# EAGLE design ou6_cs-ctrl V1.1 (EAGLE 7.6.0)
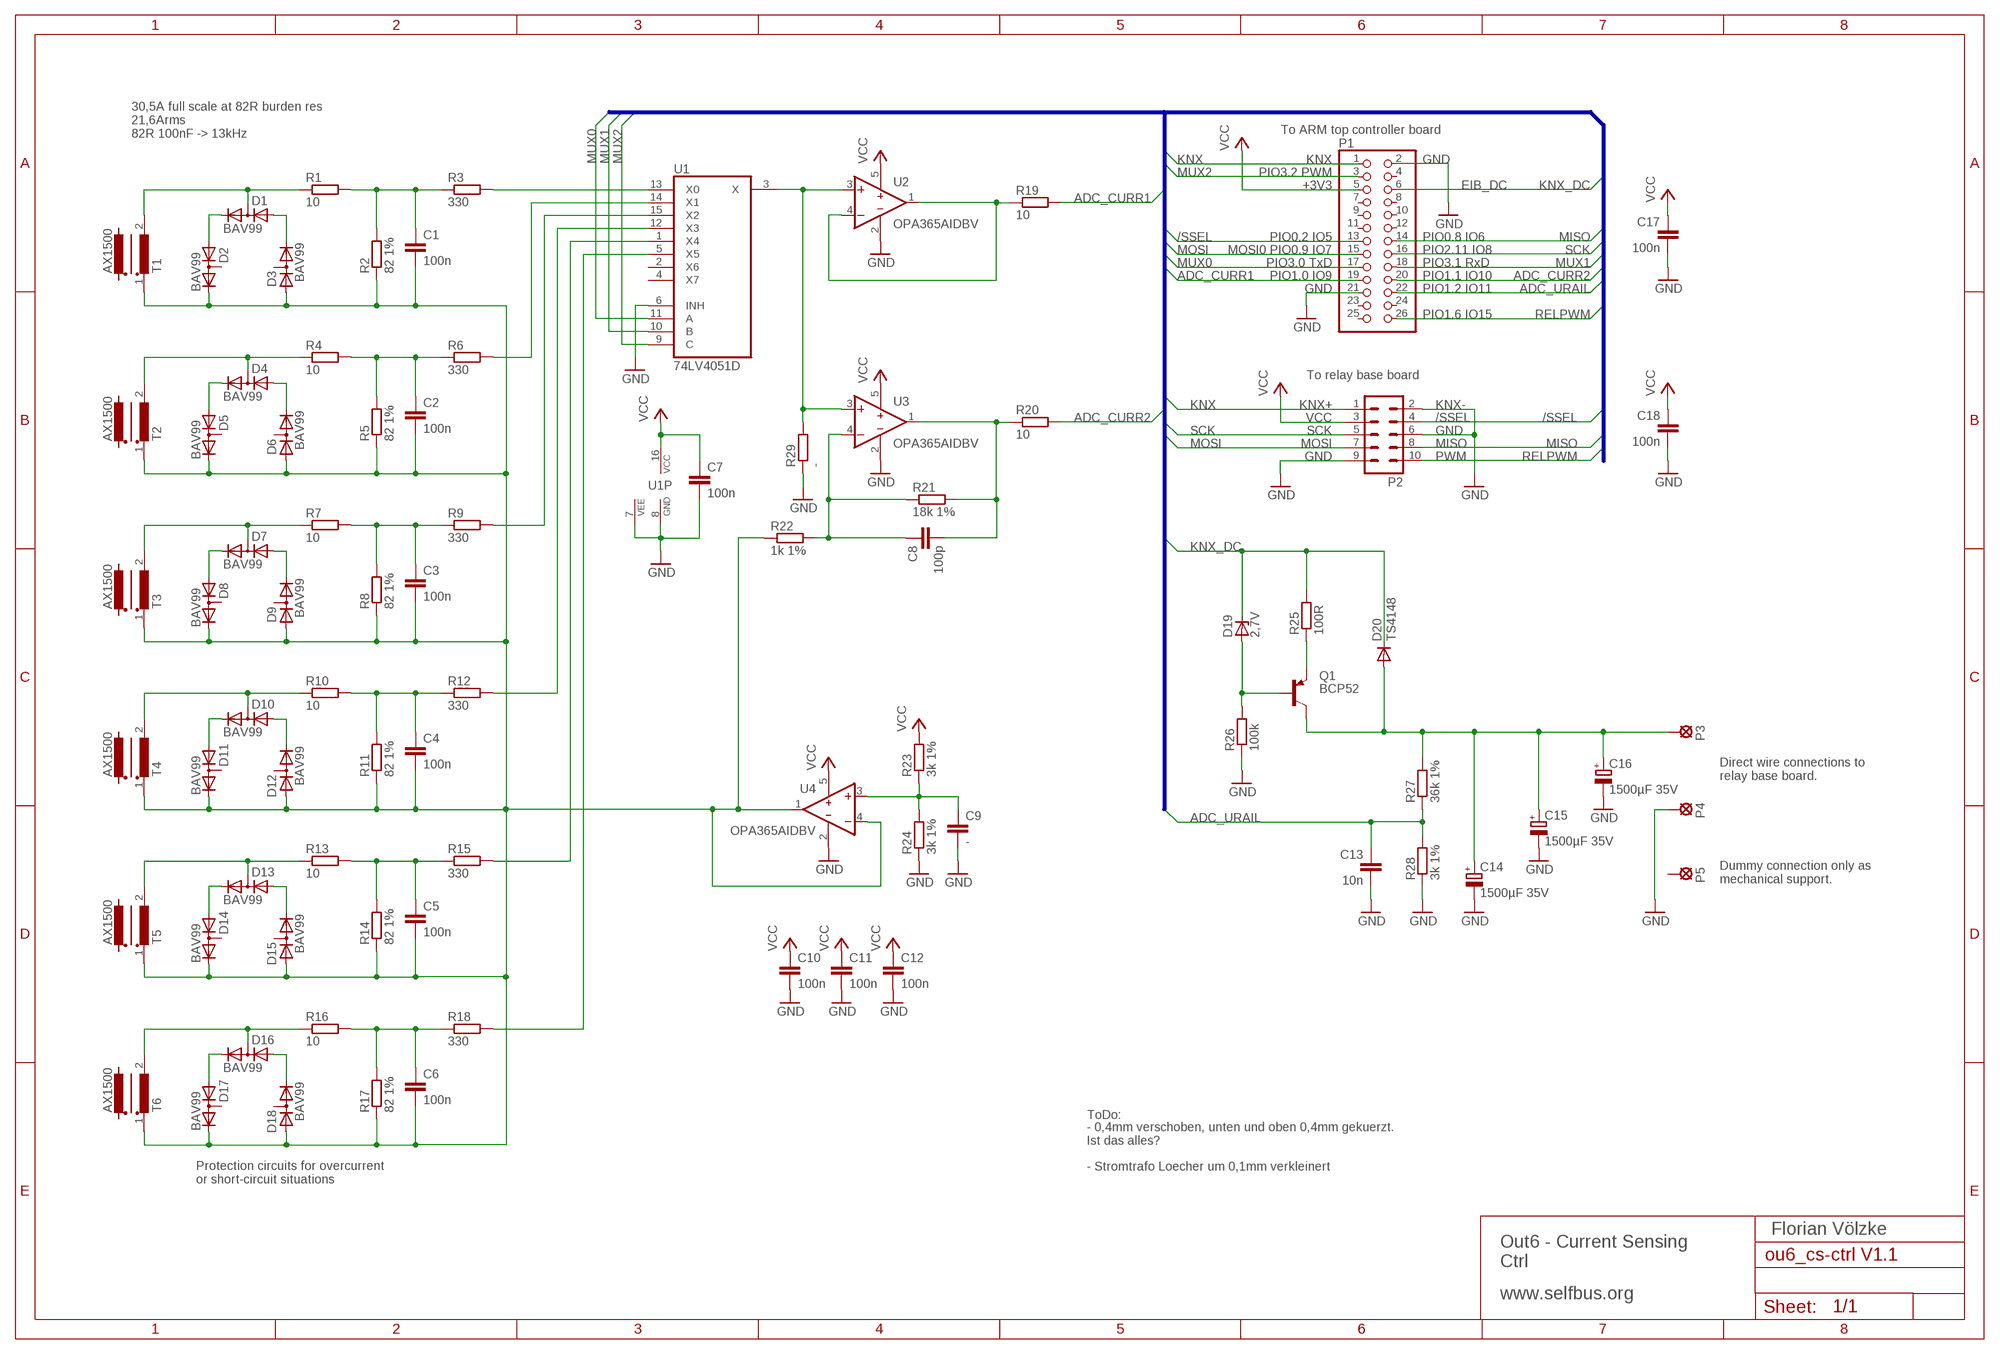
[diagram p0: schematic, sheet 1]

## Parts
C1  100n  C-EUC0805M  [R0805M]
C2  100n  C-EUC0805M  [R0805M]
C3  100n  C-EUC0805M  [R0805M]
C4  100n  C-EUC0805M  [R0805M]
C5  100n  C-EUC0805M  [R0805M]
C6  100n  C-EUC0805M  [R0805M]
C7  100n  C-EUC0805M  [R0805M]
C8  100p  C-EUC0805M  [R0805M]
C9  -  C-EUC0805M  [R0805M]
C10  100n  C-EUC0805M  [R0805M]
C11  100n  C-EUC0805M  [R0805M]
C12  100n  C-EUC0805M  [R0805M]
C13  10n  C-EUC0805M  [R0805M]
C14  1500µF 35V  CPOL-EUE5-13-30  [E5-13-30]
C15  1500µF 35V  CPOL-EUE5-13-30  [E5-13-30]
C16  1500µF 35V  CPOL-EUE5-13-30  [E5-13-30]
C17  100n  C-EUC0805M  [R0805M]
C18  100n  C-EUC0805M  [R0805M]
D1  BAV99  DIODE_2CACA-SOT23  [SOT23]
D2  BAV99  DIODE_2CACA-SOT23  [SOT23]
D3  BAV99  DIODE_2CACA-SOT23  [SOT23]
D4  BAV99  DIODE_2CACA-SOT23  [SOT23]
D5  BAV99  DIODE_2CACA-SOT23  [SOT23]
D6  BAV99  DIODE_2CACA-SOT23  [SOT23]
D7  BAV99  DIODE_2CACA-SOT23  [SOT23]
D8  BAV99  DIODE_2CACA-SOT23  [SOT23]
D9  BAV99  DIODE_2CACA-SOT23  [SOT23]
D10  BAV99  DIODE_2CACA-SOT23  [SOT23]
D11  BAV99  DIODE_2CACA-SOT23  [SOT23]
D12  BAV99  DIODE_2CACA-SOT23  [SOT23]
D13  BAV99  DIODE_2CACA-SOT23  [SOT23]
D14  BAV99  DIODE_2CACA-SOT23  [SOT23]
D15  BAV99  DIODE_2CACA-SOT23  [SOT23]
D16  BAV99  DIODE_2CACA-SOT23  [SOT23]
D17  BAV99  DIODE_2CACA-SOT23  [SOT23]
D18  BAV99  DIODE_2CACA-SOT23  [SOT23]
D19  2,7V  ZENER-DIODESOT23  [SOT23]
D20  TS4148  DIODE-D0805  [D0805]
P1  PINHD-2X13SMD  [2X13SMD]
P2  ML10  [ML10]
P3  SE1.5  [SE15]
P4  SE1.5  [SE15]
P5  SE1.5  [SE15]
Q1  BCP52  FZT753SMD  [SOT223]
R1  10  R-EU_R0805M  [R0805M]
R2  82 1%  R-EU_R0805M  [R0805M]
R3  330  R-EU_R0805M  [R0805M]
R4  10  R-EU_R0805M  [R0805M]
R5  82 1%  R-EU_R0805M  [R0805M]
R6  330  R-EU_R0805M  [R0805M]
R7  10  R-EU_R0805M  [R0805M]
R8  82 1%  R-EU_R0805M  [R0805M]
R9  330  R-EU_R0805M  [R0805M]
R10  10  R-EU_R0805M  [R0805M]
R11  82 1%  R-EU_R0805M  [R0805M]
R12  330  R-EU_R0805M  [R0805M]
R13  10  R-EU_R0805M  [R0805M]
R14  82 1%  R-EU_R0805M  [R0805M]
R15  330  R-EU_R0805M  [R0805M]
R16  10  R-EU_R0805M  [R0805M]
R17  82 1%  R-EU_R0805M  [R0805M]
R18  330  R-EU_R0805M  [R0805M]
R19  10  R-EU_R0805M  [R0805M]
R20  10  R-EU_R0805M  [R0805M]
R21  18k 1%  R-EU_R0805M  [R0805M]
R22  1k 1%  R-EU_R0805M  [R0805M]
R23  3k 1%  R-EU_R0805M  [R0805M]
R24  3k 1%  R-EU_R0805M  [R0805M]
R25  100R  R-EU_R0805M  [R0805M]
R26  100k  R-EU_R0805M  [R0805M]
R27  36k 1%  R-EU_R0805M  [R0805M]
R28  3k 1%  R-EU_R0805M  [R0805M]
R29  -  R-EU_R0805M  [R0805M]
T1  AX1500  STROMWANDLERTALEMA_AX1500  [SMALLXFORMER]
T2  AX1500  STROMWANDLERTALEMA_AX1500  [SMALLXFORMER]
T3  AX1500  STROMWANDLERTALEMA_AX1500  [SMALLXFORMER]
T4  AX1500  STROMWANDLERTALEMA_AX1500  [SMALLXFORMER]
T5  AX1500  STROMWANDLERTALEMA_AX1500  [SMALLXFORMER]
T6  AX1500  STROMWANDLERTALEMA_AX1500  [SMALLXFORMER]
U1  74LV4051D  4051D  [SO16]
U2  OPA365AIDBV  LTC2050CS5  [SOT23-5]
U3  OPA365AIDBV  LTC2050CS5  [SOT23-5]
U4  OPA365AIDBV  LTC2050CS5  [SOT23-5]

## Nets
/SSEL: P1.13 P2.4
ADC_CURR1: P1.19 R19.2
ADC_CURR2: P1.20 R20.2
ADC_URAIL: C13.1 P1.22 R27.1 R28.2
GND: C7.2 C9.2 C10.2 C11.2 C12.2 C13.2 C14.- C15.- C16.- C17.2 C18.2 P1.2 P1.21 P2.2 P2.6 P2.9 P4.MP R24.1 R26.1 R28.1 R29.1 U1.6(INH) U1.7(VEE) U1.8(GND) U2.2(V-) U3.2(V-) U4.2(V-)
KNX: P1.1 P2.1
KNX_DC: D19.3(C) D20.C P1.6 R25.2
MISO: P1.14 P2.8
MOSI: P1.15 P2.7
MUX0: P1.17 U1.11(A)
MUX1: P1.18 U1.10(B)
MUX2: P1.3 U1.9(C)
N$1: R19.1 U2.1(OUT) U2.4(-IN)
N$2: D1.3(AC) R1.1 T1.2(W1E)
N$3: D1.2(C) D2.1(A)
N$4: D1.1(A) D3.2(C)
N$5: C1.1 R1.2 R2.2 R3.1
N$6: Q1.3(E) R25.1
N$7: D4.3(AC) R4.1 T2.2(W1E)
N$8: D4.2(C) D5.1(A)
N$9: D4.1(A) D6.2(C)
N$10: C2.1 R4.2 R5.2 R6.1
N$11: C8.2 R20.1 R21.2 U3.1(OUT)
N$12: D7.3(AC) R7.1 T3.2(W1E)
N$13: D7.2(C) D8.1(A)
N$14: D7.1(A) D9.2(C)
N$15: C3.1 R7.2 R8.2 R9.1
N$16: R29.2 U1.3(X) U2.3(+IN) U3.3(+IN)
N$17: D10.3(AC) R10.1 T4.2(W1E)
N$18: D10.2(C) D11.1(A)
N$19: D10.1(A) D12.2(C)
N$20: C4.1 R10.2 R11.2 R12.1
N$21: C8.1 R21.1 R22.2 U3.4(-IN)
N$22: D13.3(AC) R13.1 T5.2(W1E)
N$23: D13.2(C) D14.1(A)
N$24: D13.1(A) D15.2(C)
N$25: C5.1 R13.2 R14.2 R15.1
N$26: C1.2 C2.2 C3.2 C4.2 C5.2 C6.2 D2.2(C) D3.1(A) D5.2(C) D6.1(A) D8.2(C) D9.1(A) D11.2(C) D12.1(A) D14.2(C) D15.1(A) D17.2(C) D18.1(A) R2.1 R5.1 R8.1 R11.1 R14.1 R17.1 R22.1 T1.1(W1A) T2.1(W1A) T3.1(W1A) T4.1(W1A) T5.1(W1A) T6.1(W1A) U4.1(OUT) U4.4(-IN)
N$27: D16.3(AC) R16.1 T6.2(W1E)
N$28: D16.2(C) D17.1(A)
N$29: D16.1(A) D18.2(C)
N$30: C6.1 R16.2 R17.2 R18.1
N$31: R3.2 U1.13(X0)
N$32: R6.2 U1.14(X1)
N$33: R9.2 U1.15(X2)
N$34: R12.2 U1.12(X3)
N$35: R15.2 U1.1(X4)
N$36: R18.2 U1.5(X5)
N$37: C9.1 R23.1 R24.2 U4.3(+IN)
N$38: C14.+ C15.+ C16.+ D20.A P3.MP Q1.2(C) Q1.4(C) R27.2
N$41: D19.1(A) Q1.1(B) R26.2
RELPWM: P1.26 P2.10
SCK: P1.16 P2.5
VCC: C7.1 C10.1 C11.1 C12.1 C17.1 C18.1 P1.5 P2.3 R23.2 U1.16(VCC) U2.5(V+) U3.5(V+) U4.5(V+)
Unconnected: D2.3(AC) D3.3(AC) D5.3(AC) D6.3(AC) D8.3(AC) D9.3(AC) D11.3(AC) D12.3(AC) D14.3(AC) D15.3(AC) D17.3(AC) D18.3(AC) P1.4 P1.7 P1.8 P1.9 P1.10 P1.11 P1.12 P1.23 P1.24 P1.25 P5.MP U1.2(X6) U1.4(X7)

## Buses
MUX[0..2],ADC_CURR[1..2],ADC_URAIL,RELPWM,/SSEL,SCK,MOSI,MISO,KNX,KNX_DC

## Notes on the sheet
- To ARM top controller board
- 30,5A full scale at 82R burden res
  21,6Arms
  82R 100nF -> 13kHz
- KNX | GND
- PIO3.2 PWM
- +3V3 | EIB_DC
- PIO0.2 IO5 | PIO0.8 IO6
- MOSI0 PIO0.9 IO7 | PIO2.11 IO8
- PIO3.0 TxD | PIO3.1 RxD
- PIO1.0 IO9 | PIO1.1 IO10
- GND | PIO1.2 IO11
- PIO1.6 IO15
- To relay base board
- KNX+ | KNX-
- VCC | /SSEL
- SCK | GND
- MOSI | MISO
- GND | PWM
- Direct wire connections to
  relay base board.
- Dummy connection only as
  mechanical support.
- ToDo:
- - 0,4mm verschoben, unten und oben 0,4mm gekuerzt.
  Ist das alles?
- - Stromtrafo Loecher um 0,1mm verkleinert
- Protection circuits for overcurrent
  or short-circuit situations
- Out6 - Current Sensing
  Ctrl
- Florian Völzke
- www.selfbus.org

## Library data of the parts
C1-C13 C17 C18 = rcl:C-EU: CAPACITOR, European symbol
C14-C16 = rcl:CPOL-EU: POLARIZED CAPACITOR, European symbol
D1-D18 = diode:DIODE_2CACA-: 2 Diodes - Cathode-Anode|Cathode-Anode
D19 = diode:ZENER-DIODE: Z-Diode
D20 = diode:DIODE-: DIODE
P1 = pinhead:PINHD-2X13: PIN HEADER
P2 = con-harting-ml:ML10: HARTING; OC_FARNELL: unknown; OC_NEWARK: unknown
P3-P5 = solpad:SE: SOLDER PAD drill in mm
Q1 = transistor-pnp:FZT753SMD: PNP Transistor
R1-R29 = rcl:R-EU_: RESISTOR, European symbol
T1-T6 = eigene:STROMWANDLER
U1 = 40xx:4051: 8-channel ANALOG MULTIPLEXER
U2-U4 = eigene:LTC2050

## Board
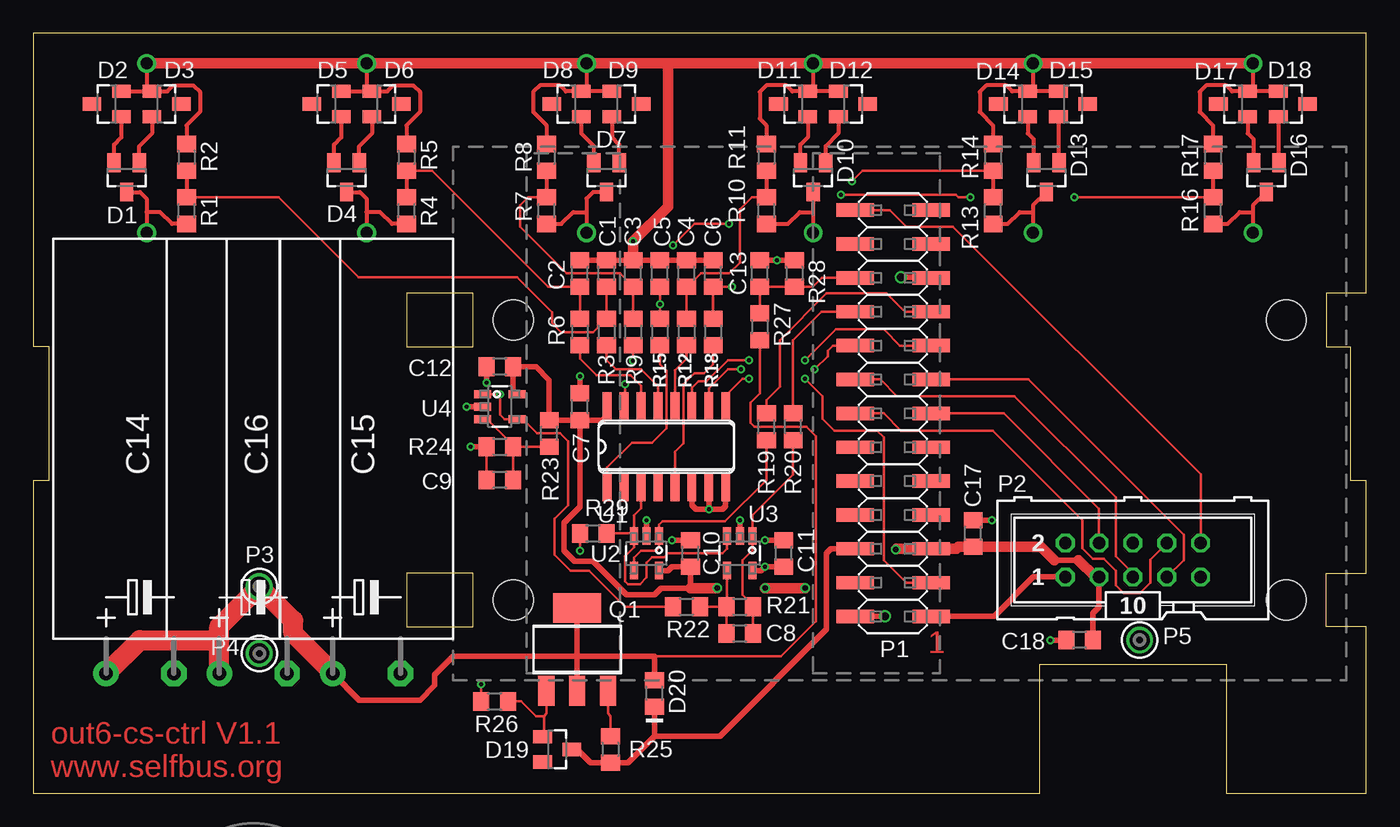
[diagram p1: board, top side]
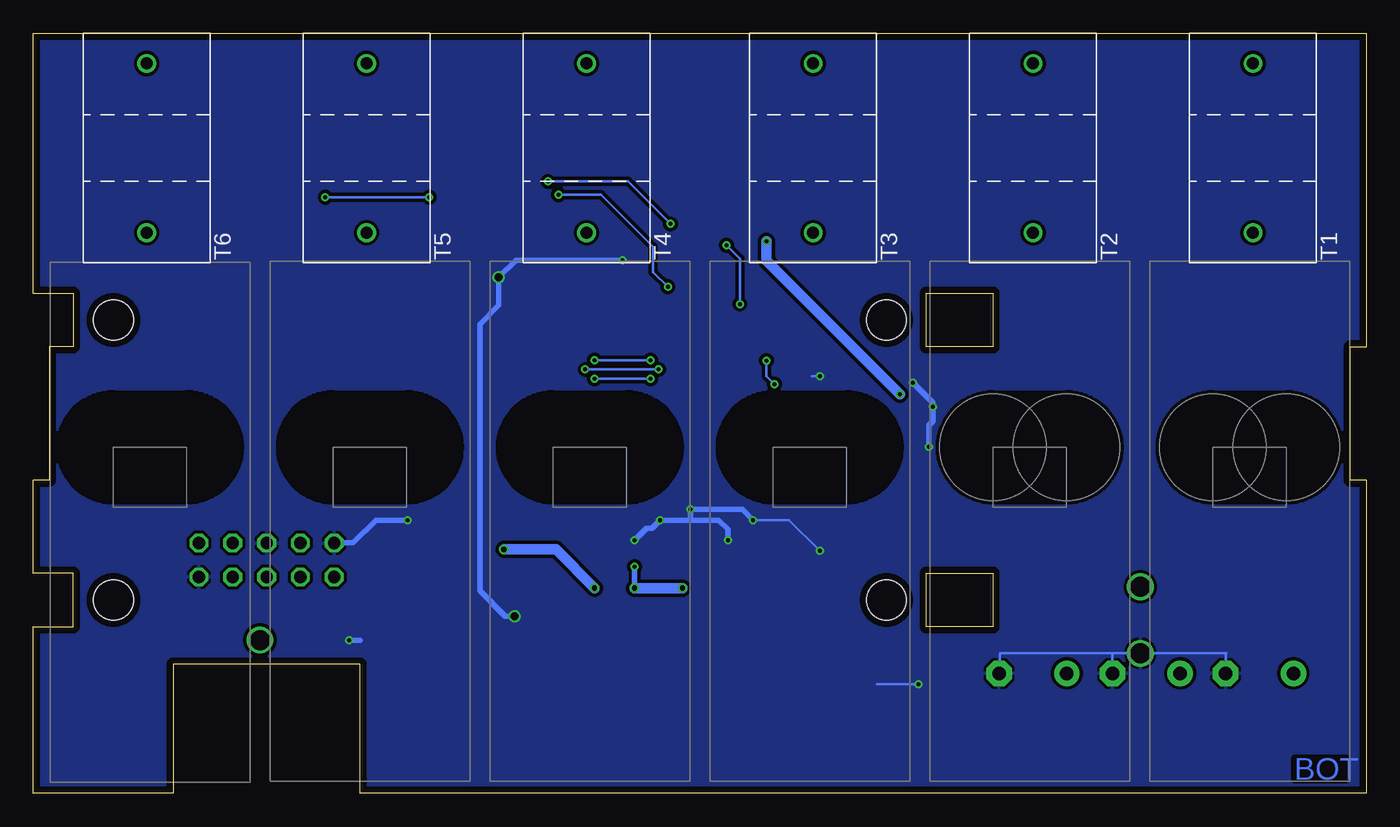
[diagram p2: board, bottom side, seen from below]

Size 100 x 57 mm. Coordinates in mm from the lower left corner, seen from the top.
Outline: 0,0 75.5,0 75.5,9.7 89.5,9.7 89.5,0 100,0 100,12.5 97,12.5 97,16.5 100,16.5 100,23.5 98.8,23.5 98.8,33.5 97,33.5 97,37.5 100,37.5 100,57 0,57 0,33.5 1.2,33.5 1.2,23.5 0,23.5 0,0
Outline: 33,37.5 28,37.5 28,33.5 33,33.5 33,37.5
Outline: 33,16.5 28,16.5 28,12.5 33,12.5 33,16.5
Copper layers (1*16): Top 0.035mm / dielectric 1.5mm / Bottom 0.035mm
Design rules "default *": minimum track width 0.2mm, minimum drill 0.3mm, track to track 0.2mm, track to pad 0.2mm, pad to pad 0.2mm, via to via 0.2mm, smd to smd 0.2mm, copper to edge 0.5mm, drill to drill 0.5mm, minimum pad ring 0.25mm, minimum via ring 0.15mm, stop-mask expansion 4mil, vias tented up to drill 0.6mm, thermal gap 0.2mm
Holes 3 mm at 94,35.5 94,14.5 36,14.5 36,35.5
bRestrict: area 2,21.9 to 15.5,29.9; area 18.5,21.9 to 32,29.9; area 35,21.9 to 48.5,29.9; area 51.5,21.9 to 65,29.9; area 68,21.9 to 81.5,29.9; area 84.5,21.9 to 98,29.9

### Footprints (pad centres in the part's own frame; a part is rotated, then mirrored left to right if it is on the bottom)
R0805M = smd 1.2 x 1.4: 1 -1,0; 2 1,0
E5-13-30 = drill 1.016 pad 1.905: + -2.54,0 | drill 1.016 pad 1.905 octagon: - 2.54,0
SOT23 = smd 1 x 1.4: 1 -0.95,-1.1; 2 0.95,-1.1; 3 0,1.1
D0805 = smd 1.2 x 1.4: A 1,0; C -1,0
2X13SMD = smd 1 x 2.8: 1 -15.24,-2.85; 2 -15.24,2.85; 3 -12.7,-2.85; 4 -12.7,2.85; 5 -10.16,-2.85; 6 -10.16,2.85; 7 -7.62,-2.85; 8 -7.62,2.85; 9 -5.08,-2.85; 10 -5.08,2.85; 11 -2.54,-2.85; 12 -2.54,2.85; 13 0,-2.85; 14 0,2.85; 15 2.54,-2.85; 16 2.54,2.85; 17 5.08,-2.85; 18 5.08,2.85; 19 7.62,-2.85; 20 7.62,2.85; 21 10.16,-2.85; 22 10.16,2.85; 23 12.7,-2.85; 24 12.7,2.85; 25 15.24,-2.85; 26 15.24,2.85
ML10 = drill 0.914 octagon: 1 -5.08,-1.27; 2 -5.08,1.27; 3 -2.54,-1.27; 4 -2.54,1.27; 5 0,-1.27; 6 0,1.27; 7 2.54,-1.27; 8 2.54,1.27; 9 5.08,-1.27; 10 5.08,1.27
SE15 = drill 1.5: MP 0,0
SOT223 = smd 1.219 x 2.235: 1 -2.311,-3.099; 2 0,-3.099; 3 2.311,-3.099 | smd 3.6 x 2.2: 4 0,3.099
SMALLXFORMER = drill 0.9: 1 -6.35,0; 2 6.35,0
SO16 = smd 0.66 x 2.032: 1 -4.445,-3.073; 2 -3.175,-3.073; 3 -1.905,-3.073; 4 -0.635,-3.073; 5 0.635,-3.073; 6 1.905,-3.073; 7 3.175,-3.073; 8 4.445,-3.073; 9 4.445,3.073; 10 3.175,3.073; 11 1.905,3.073; 12 0.635,3.073; 13 -0.635,3.073; 14 -1.905,3.073; 15 -3.175,3.073; 16 -4.445,3.073
SOT23-5 = smd 1.3 x 0.6: 1 -1.295,0.94; 2 -1.295,0; 3 -1.295,-0.94; 4 1.295,-0.94; 5 1.295,0.94

### Placement (x,y rotation side)
C1  43,39 90 top
C2  41,39 90 top
C3  45,39 90 top
C4  49,39 90 top
C5  47,39 90 top
C6  51,39 90 top
C7  41,29 90 top
C8  53,12 0 top
C9  35,23.5 180 top
C10  49.3,18 90 top
C11  56.3,18 90 top
C12  35,32 180 top
C13  54.5,39 90 top
C14  8,9 0 top
C15  25,9 0 top
C16  16.5,9 0 top
C17  70.5,19.5 90 top
C18  78.5,11.5 180 top
D1  7,46.2 180 top
D2  5.5,51.7 90 top
D3  10,51.7 270 top
D4  23.5,46.2 180 top
D5  22,51.7 90 top
D6  26.5,51.7 270 top
D7  43,46.2 180 top
D8  40,51.7 90 top
D9  44.5,51.7 270 top
D10  58.5,46.2 180 top
D11  57,51.7 90 top
D12  61.5,51.7 270 top
D13  76,46.2 180 top
D14  73.5,51.7 90 top
D15  78,51.7 270 top
D16  92.5,46.2 180 top
D17  90,51.7 90 top
D18  94.5,51.7 270 top
D19  39.3,3.3 270 top
D20  46.6,7.5 90 top
P1  64.5,28.5 90 top
P2  82.5,17.5 0 top
P3  16.95,15.5 0 top
P4  16.95,10.5 0 top
P5  83,11.5 0 top
Q1  40.8,10.8 0 top
R1  11.5,43.7 90 top
R2  11.5,47.7 270 top
R3  43,34.6 270 top
R4  28,43.7 90 top
R5  28,47.7 270 top
R6  41,34.6 270 top
R7  38.5,43.7 90 top
R8  38.5,47.7 270 top
R9  45,34.6 270 top
R10  55,43.7 90 top
R11  55,47.7 270 top
R12  49,34.6 270 top
R13  72,43.7 90 top
R14  72,47.7 270 top
R15  47,34.6 270 top
R16  88.5,43.7 90 top
R17  88.5,47.7 270 top
R18  51,34.6 270 top
R19  55,27.5 90 top
R20  57,27.5 90 top
R21  53,14 0 top
R22  49,14 0 top
R23  38.7,27 90 top
R24  35,26 0 top
R25  43.3,3.3 270 top
R26  34.6,6.9 0 top
R27  54.5,35 270 top
R28  57.1,39 270 top
R29  42,19.5 0 top
T1  8.5,48.4 270 bottom
T2  25,48.4 270 bottom
T3  41.5,48.4 270 bottom
T4  58.5,48.4 270 bottom
T5  75,48.4 270 bottom
T6  91.5,48.4 270 bottom
U1  47.5,26 0 top
U2  46,18 270 top
U3  53,18 270 top
U4  35,29 0 top

### Tracks (layer width: path | path; a pad name or v marks a point on that pad's centre or on a via)
/SSEL
  Top 0.2: P1.13 72.8,28.5 79.96,21.34 P2.4
ADC_CURR1
  Top 0.2: P1.19 65.38,36.12 64,37.5 59.5,37.5 56,34 56,30.5 55,29.5 R19.2
ADC_CURR2
  Top 0.2: P1.20 59.12,36.12 57,34 R20.2
ADC_URAIL
  Top 0.2: P1.22 59.16,38.66 58.5,38 R28.2 C13.1 R27.1
GND  (via drill 0.3, 0.6)
  Top 0.2: R26.1 v33.6,8.2 | C9.2 R24.1 | R29.1 v41,18.2
  Top 0.4: C7.2 v41,31.3 | C18.2 v76.3,11.5 | P1.21 67.39,38.7 v65.1,38.7 | P1.2 61.69,13.3 v63.9,13.3 | U2.2 v46,20.5 | v50.7,21.3 50.7,22.2 50.67,22.23 U1.7 | U1.6 49.41,21.59 49.7,21.3 v50.7,21.3 | U1.8 51.95,21.55 51.7,21.3 v50.7,21.3 | C10.2 v47.9,19 | U3.2 v53,20.5 | C11.2 v54.9,19 | C12.2 v34,30.8 | U4.2 v32.5,29 | R24.1 v32.8,26 | C17.2 v71.9,20.5 | C13.2 v55.8,40 R28.1
  Bottom 0.2: v41,31.3 41.6,31.3 | v33.6,8.2 36.7,8.2 | C14.- 10.54,10.46 10.5,10.5 P4.MP 19.04,10.5 | 19.04,10.5 27.5,10.5 27.5,9.04 C15.- | C16.- 19.04,10.5 | v41,18.2 43.3,20.5 v46,20.5
  Bottom 0.4: v76.3,11.5 75.5,11.5 | v63.9,13.3 64.6,13.3 66.5,15.2 66.5,35.2 65.1,36.6 v65.1,38.7 63.8,40 v55.8,40 | v46,20.5 46.8,21.3 v50.7,21.3 50.7,20.5 | v47.9,19 47.9,19.8 48.6,20.5 50.7,20.5 | 50.7,20.5 v53,20.5 53.6,19.9 54,19.9 v54.9,19 | v34,30.8 32.5,29.3 v32.5,29 32.5,27.9 32.8,27.6 v32.8,26 | v71.9,20.5 74.3,20.5 76,18.8 77.39,18.8 P2.2
  pour Bottom (isolate 0.25): 0,57 0,0 100,0 100,57
KNX
  Top 0.4: P1.1 67.96,13.26 68,13.3 72.1,13.3 75.03,16.23 P2.1
KNX_DC
  Top 0.4: P1.6 59.84,18.34 59.5,18 59.5,12.3 51.5,4.3 46.6,4.3 | D19.3 40.8,3.3 41.8,2.3 R25.2 44.6,2.3 46.6,4.3 | 46.6,4.3 D20.C
MISO
  Top 0.2: P1.14 63.8,28.5 65.1,27.2 72,27.2 78.7,20.5 78.7,18.4 79.5,17.6 80.3,17.6 81.2,16.7 81.2,15.6 81.8,15 83,15 83.8,15.8 83.8,17.53 P2.8
MOSI
  Top 0.2: P1.15 74.66,31.04 86.3,19.4 86.3,17.49 P2.7
MUX0  (via drill 0.3)
  Top 0.2: U1.11 49.41,30.41 49.9,30.9 50.5,30.9 52.1,32.5 v53.7,32.5 | P1.17 65.02,33.58 63.8,34.8 60.2,34.8 v57.9,32.5
  Bottom 0.2: v53.7,32.5 v57.9,32.5
MUX1  (via drill 0.3)
  Top 0.2: U1.10 50.67,30.38 52.1,31.8 v53.1,31.8 | P1.18 59.98,33.58 59.6,33.2 59.6,32.8 v58.6,31.8
  Bottom 0.2: v53.1,31.8 v58.6,31.8
MUX2  (via drill 0.3)
  Top 0.2: P1.3 65.5,15.8 63.8,17.5 63.8,26.7 63.3,27.2 60.1,27.2 59.2,28.1 59.2,29.8 v57.9,31.1 | 51.97,29.1 U1.9 52,29.13 52,29.9 53.2,31.1 v53.7,31.1
  Bottom 0.2: v57.9,31.1 v53.7,31.1
N$1
  Top 0.2: U2.4 45.06,17.66 45.6,18.2 46.7,18.2 46.94,18.44 U2.1 46.94,20.14 47.2,20.4 51.9,20.4 55,23.5 R19.1
N$2
  Top 0.3: D1.3 8,45.1 8.5,44.6 8.5,43.6 | 8.5,43.6 T1.2 | R1.1 10.4,42.7 9.5,43.6 8.5,43.6
N$3
  Top 0.3: D2.1 6.6,49.2 6.05,48.65 D1.2
N$4
  Top 0.3: D1.1 7.95,48.55 8.9,49.5 D3.2
N$5
  Top 0.2: C1.1 R3.1 42,34.6 39.6,34.6 38.9,35.3 38.9,36.1 36.3,38.7 24.4,38.7 18.4,44.7 R1.2
  Top 0.3: R2.2 R1.2
N$6
  Top 0.2: Q1.3 43.11,5.99 43.3,5.8 R25.1
N$7
  Top 0.3: D4.3 24.5,45.1 25,44.6 25,43.6 | 25,43.6 T2.2 | R4.1 26.9,42.7 26,43.6 25,43.6
N$8
  Top 0.3: D5.1 23.1,49.2 22.55,48.65 D4.2
N$9
  Top 0.3: D6.2 25.4,49.5 24.45,48.55 D4.1
N$10
  Top 0.2: R6.1 C2.1 38.6,38 29.9,46.7 R5.2
  Top 0.3: R5.2 R4.2
N$11
  Top 0.2: R20.1 57,23.9 53.94,20.84 U3.1 53.94,18.24 53.2,17.5 53.2,14.9 53.8,14.3 53.8,14.2 R21.2 C8.2
N$12
  Top 0.3: D7.3 42,45.1 41.5,44.6 41.5,43.6 | 41.5,43.6 T3.2 | R7.1 39.6,42.7 40.5,43.6 41.5,43.6
N$13
  Top 0.3: D8.1 41.1,49.5 42.05,48.55 D7.2
N$14
  Top 0.3: D9.2 43.4,49.2 43.95,48.65 D7.1
N$15
  Top 0.2: R9.1 C3.1 44,39 40,39 36.5,42.5 36.5,44.1 37.1,44.7 R7.2
  Top 0.3: R8.2 R7.2
N$16
  Top 0.2: U1.3 45.59,21.41 45.6,21.4 45.06,20.86 45.06,19.5 | 45.06,19.5 U2.3 45.06,18.46 44.4,17.8 44.4,15.9 44.6,15.7 45.5,15.7 46,16.2 46,17.3 46.4,17.7 47.3,17.7 47.6,18 51.7,18 52.06,18.36 U3.3 | R29.2 45.06,19.5
N$17
  Top 0.3: D10.3 58.5,43.6 | 58.5,43.6 T4.2 | R10.1 56.6,42.7 57.5,43.6 58.5,43.6
N$18
  Top 0.3: D11.1 58.1,49.2 57.55,48.65 D10.2
N$19
  Top 0.3: D12.2 60.4,49.5 59.45,48.55 D10.1
N$20
  Top 0.2: R12.1 C4.1 49.1,38 50.1,39 52.2,39 53,39.8 53,43.8 53.9,44.7 R10.2
  Top 0.3: R11.2 R10.2
N$21
  Top 0.2: C8.1 R21.1 | U3.4 52.06,14.06 R21.1 | R21.1 R22.2
N$22
  Top 0.3: D13.3 75,44.1 75,43.6 | 75,43.6 T5.2 | R13.1 73.1,42.7 74,43.6 75,43.6
N$23
  Top 0.3: D14.1 74.6,49.5 75.05,49.05 D13.2
N$24
  Top 0.3: D15.2 76.9,47.35 D13.1
N$25  (via drill 0.3)
  Top 0.2: R15.1 v47,36.7 C5.1 | v48,41.1 49.6,42.7 v52.2,42.7 | v61.4,45.9 62.2,46.7 R14.2
  Top 0.3: R14.2 R13.2
  Bottom 0.2: v47,36.7 47,40.1 v48,41.1 | v52.2,42.7 55.4,45.9 v61.4,45.9
N$26  (via drill 0.3)
  Top 0.2: U4.1 v35,29.94 35,28.4 35.34,28.06 U4.4 36.36,28 36.8,28 37.8,27 39.5,27 40.1,26.4 40.1,21.6 39.1,20.6 39.1,17.9 40.3,16.7 41.7,16.7 44.4,14 R22.1
  Top 0.3: D2.2 8.5,52.65 | 8.5,52.65 D3.1 10.05,52.65 10.5,53.1 12,53.1 12.5,52.6 12.5,51.1 11.5,50.1 R2.1 | T1.1 8.5,52.65 | D5.2 25,52.65 | 25,52.65 D6.1 26.55,52.65 27,53.1 28.5,53.1 29,52.6 29,51.1 28,50.1 R5.1 | T2.1 25,52.65 | D9.1 41.5,52.65 | 41.5,52.65 D8.2 39.95,52.65 39.5,53.1 38,53.1 37.5,52.6 37.5,51.1 38.5,50.1 R8.1 | T3.1 41.5,52.65 | D12.1 58.5,52.65 | 58.5,52.65 D11.2 56.95,52.65 56.5,53.1 55,53.1 54.5,52.6 54.5,50.6 55,50.1 R11.1 | D15.1 75,52.65 | 75,52.65 D14.2 73.45,52.65 73,53.1 71.5,53.1 71,52.6 71,51.1 72,50.1 R14.1 | D18.1 91.5,52.65 | 91.5,52.65 D17.2 89.95,52.65 89.5,53.1 88,53.1 87.5,52.6 87.5,51.1 88.5,50.1 R17.1 | T4.1 58.5,52.65 | T5.1 75,52.65 | T6.1 91.5,52.65
  Top 0.4: C2.2 C1.2 C3.2 C5.2 C4.2 C6.2
  Top 0.8: T1.1 T2.1 T3.1 47.6,54.75 | 47.6,54.75 T4.1 T5.1 T6.1 | C3.2 v45,41.4 47.6,44 47.6,54.75
  Bottom 0.8: v35,29.94 45,39.94 v45,41.4
N$27
  Top 0.3: D16.3 91.5,44.1 91.5,43.6 | 91.5,43.6 T6.2 | R16.1 89.6,42.7 90.5,43.6 91.5,43.6
N$28
  Top 0.3: D17.1 91.1,49.5 91.55,49.05 D16.2
N$29
  Top 0.3: D18.2 93.4,47.35 D16.1
N$30  (via drill 0.3)
  Top 0.2: R18.1 C6.1 v52.4,38 | R16.2 v78.1,44.7 | v70.3,44.7 69.4,44.7 69.2,44.9 v60.6,44.9
  Top 0.3: R17.2 R16.2
  Bottom 0.2: v78.1,44.7 v70.3,44.7 | v60.6,44.9 57.4,44.9 53.5,41 53.5,39.1 v52.4,38
N$31
  Top 0.2: R3.2 43,32.5 43.7,31.8 45.6,31.8 46.87,30.54 U1.13
N$32
  Top 0.2: U1.14 45.59,30.55 44.8,31.35 42.25,31.35 41,32.6 R6.2
N$33  (via drill 0.3)
  Top 0.2: R9.2 v45,32.45 | v44.4,30.7 44.4,29 U1.15
  Bottom 0.2: v45,32.45 45,31.3 v44.4,30.7
N$34
  Top 0.2: U1.12 48.13,31.73 49,32.6 R12.2
N$35
  Top 0.2: U1.1 43.05,24.45 44.9,26.3 46.4,26.3 47.5,27.4 47.5,31.7 47,32.2 R15.2
N$36
  Top 0.2: U1.5 48.13,25.64 48.77,26.27 48.77,30.68 49.6,31.5 50.3,31.5 51,32.2 R18.2
N$37
  Top 0.2: U4.3 34.04,28.06 35.6,26.5 35.6,26.4 R24.2 | R24.2 R23.1 | C9.1 R24.2
N$38
  Top 0.2: R27.2 54.5,30 53.8,29.3 53.8,27.8 54.1,27.5 58,27.5 58.7,26.8 58.7,12.9 56.1,10.3 46.6,10.3
  Top 0.4: Q1.2 40.8,10.3 | 40.8,10.3 Q1.4 | C15.+ 24.46,7 29,7 30.1,8.1 30.1,8.9 31.5,10.3 40.8,10.3 | 40.8,10.3 46.6,10.3 D20.A
  Top 1: C15.+ 22.46,9.04 | C14.+ 5.5,9
  Top 1.5: C16.+ 13.96,11.5 | 13.96,11.5 13.96,12.51 P3.MP 19.5,12.95 19.5,12 22.46,9.04 | 5.5,9 8,11.5 13.96,11.5
N$41
  Top 0.2: Q1.1 38.49,5.99 38.3,5.8 | 38.3,5.8 38.3,4.35 D19.1 | R26.2 36.6,6.9 37.7,5.8 38.3,5.8
RELPWM
  Top 0.2: P1.26 64.26,43.74 65.5,42.5 69,42.5 87.58,23.92 P2.10
SCK
  Top 0.2: P1.16 63.54,31.04 64.78,29.8 73.6,29.8 81.2,22.2 81.2,17.8 82.5,16.5 P2.5 | P2.5 82.5,16.1 82.6,16.1 82.6,16.2 82.53,16.2 P2.5
VCC  (via drill 0.3, 0.4)
  Top 0.2: 43,28.3 43,29.02 U1.16
  Top 0.4: P2.3 79.96,13.96 79.5,13.5 C18.1 | U2.5 47.6,16.7 47.9,17 C10.1 49.3,15.4 47.1,15.4 46.6,14.9 44.5,14.9 42,17.4 40.6,17.4 39.8,18.2 39.8,20.3 41,21.5 C7.1 | U3.5 54.6,16.7 v54.9,17 C11.1 | U4.5 36,29.94 C12.1 37.7,32 38.7,31 R23.2 C7.1 | C7.1 42.7,28 43,28.3 | 78.4,17.5 76.6,17.5
  Top 0.8: 49.3,15.4 v51.3,15.4 | v64.7,18.3 64.74,18.34 P1.5 69.24,18.34 69.4,18.5 C17.1 75.6,18.5 76.6,17.5 | v57.9,15.4 v54.9,15.4 | P2.3 79.67,16.23 78.4,17.5
  Bottom 0.4: v54.9,17 v54.9,15.4
  Bottom 0.8: v51.3,15.4 v54.9,15.4 | v64.7,18.3 60.8,18.3 v57.9,15.4

### Text on the board
Top: 1 | out6-cs-ctrl V1.1 | www.selfbus.org
Bottom: BOT
tDocu: HF: Am Betaetigerausschnitt oberer Rand 1,5mm Kriechstrecke | Positionstoleranz X-Y 1,0mm | Abstand Platine zur oberen Relaiskante 3,0mm (enthält 0,5mm Höhentoleranz) | 4mm
_tsilk: 2 | 1 | 10